# Altium project project3_SensorLEM.PrjPcb
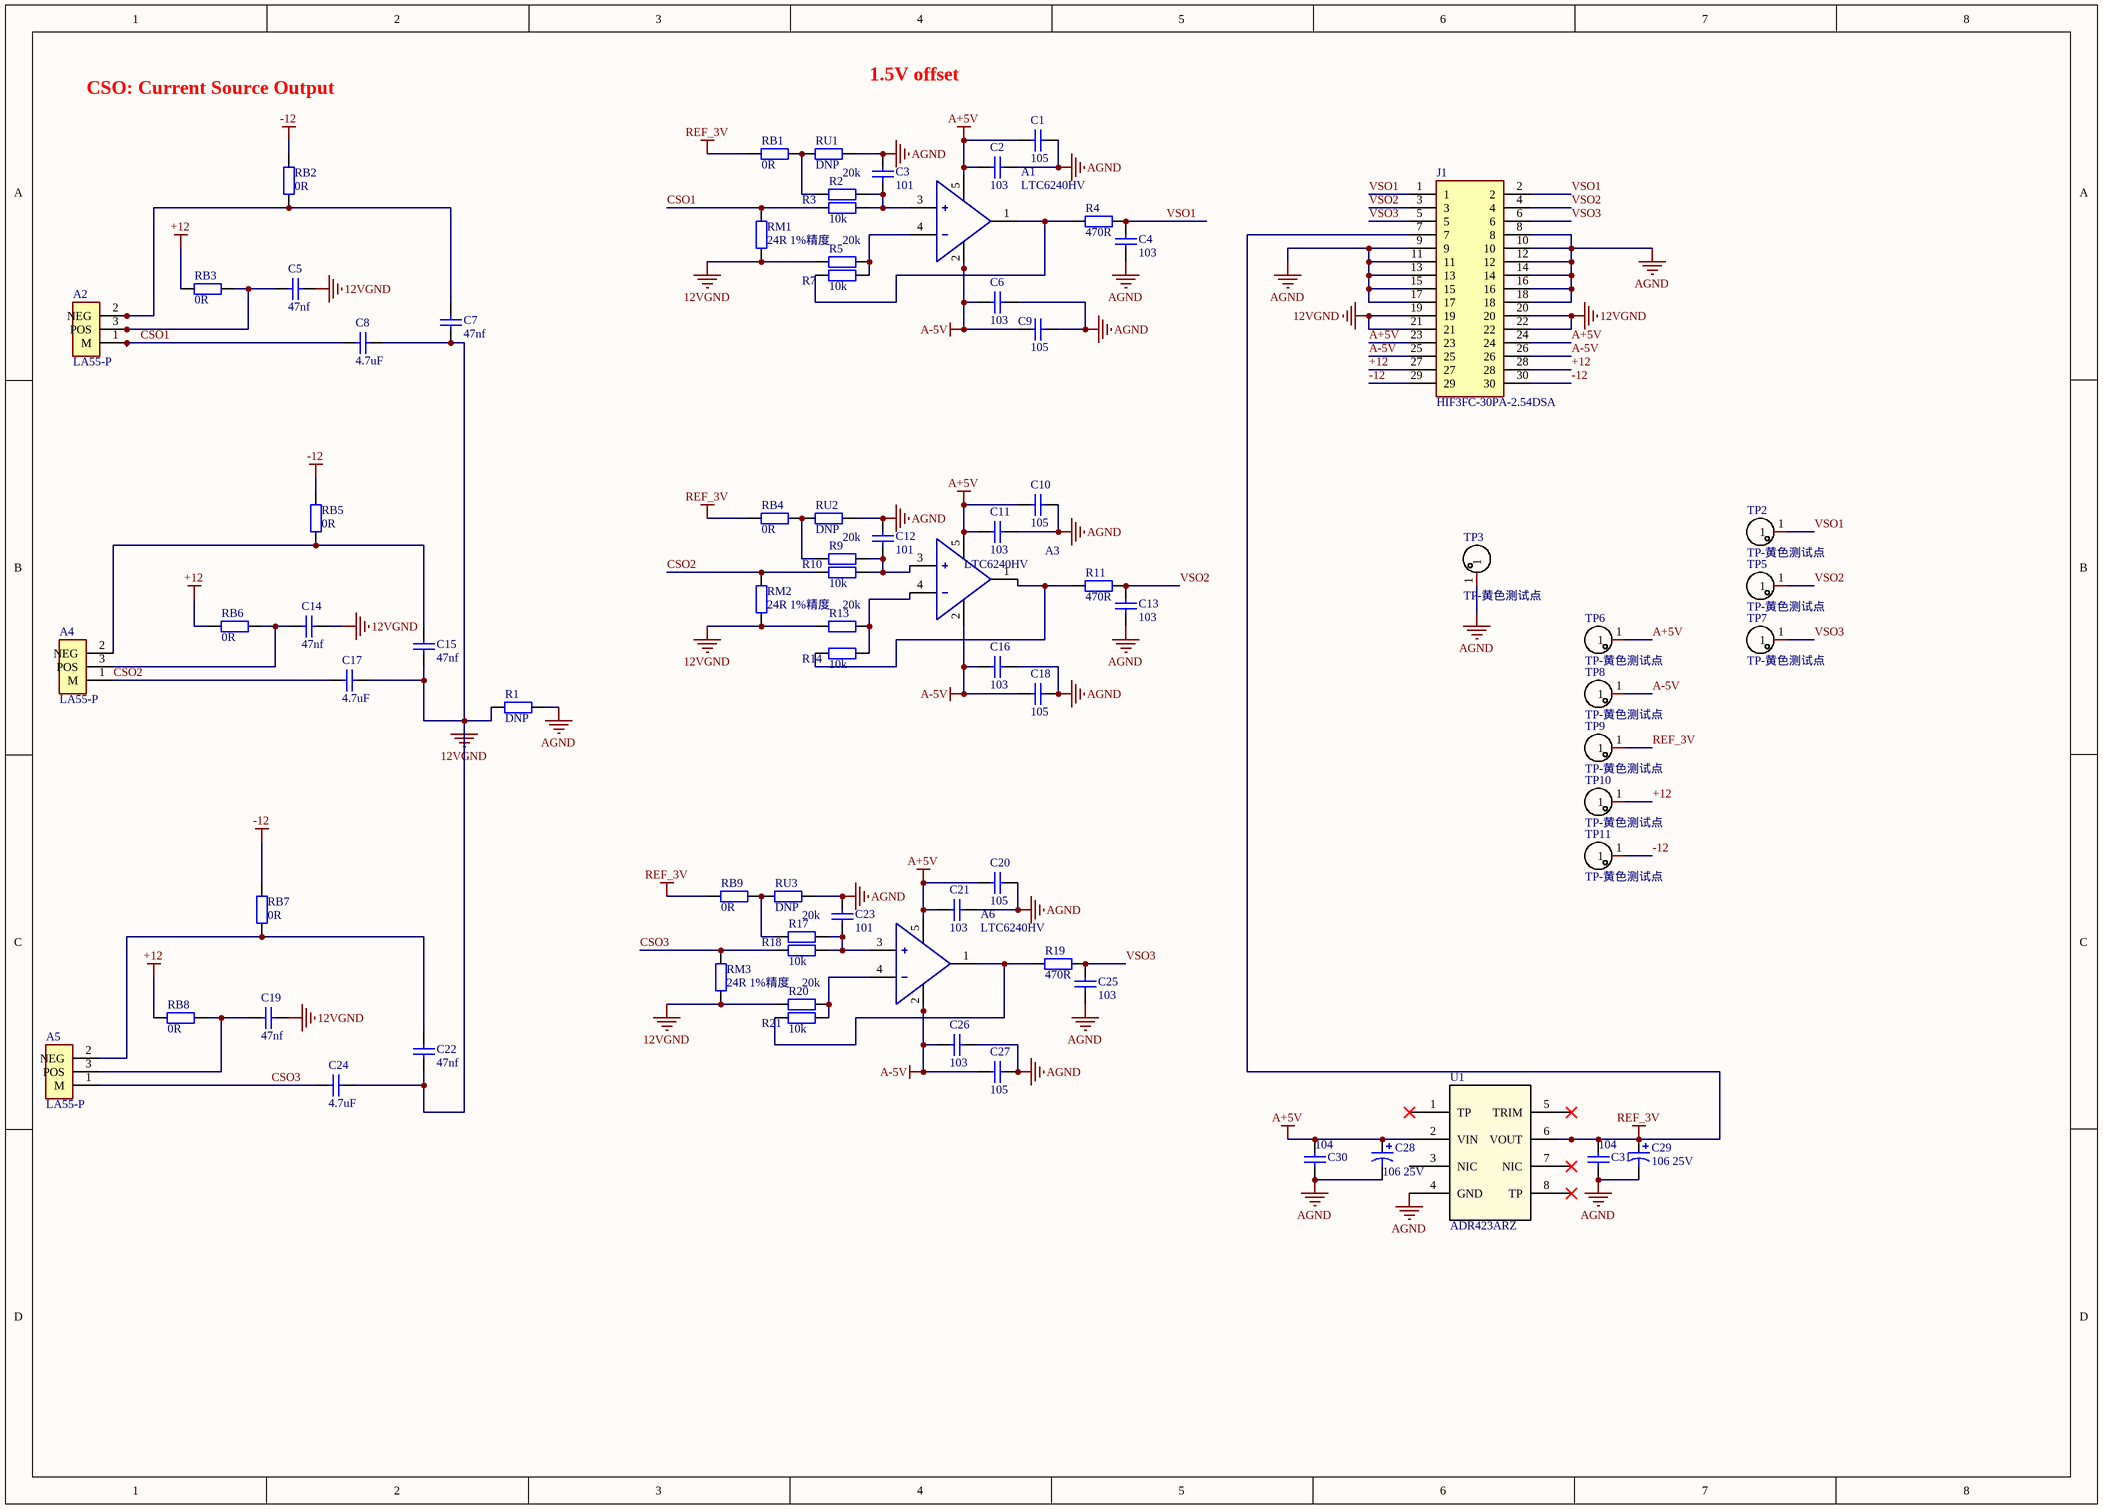
[diagram p0: sheet3.SchDoc]
1 sheet, 79 parts. Net scope: global (net labels, ports and power ports of the same name join across sheets).
Board file: PCB3.PcbDoc

## Sheet sheet3.SchDoc
size A3

### Parts
A1  LTC6240HV  [SOT95P280X100-5N]
A2  LA55-P  [XDCR_LA55-P]
A3  LTC6240HV  [SOT95P280X100-5N]
A4  LA55-P  [XDCR_LA55-P]
A5  LA55-P  [XDCR_LA55-P]
A6  LTC6240HV  [SOT95P280X100-5N]
C1  105  [0805]
C2  103  [0805]
C3  101  [0805]
C4  103  [0805]
C5  47nf  [0805]
C6  103  [0805]
C7  47nf  [0805]
C8  4.7uF  [0805]
C9  105  [0805]
C10  105  [0805]
C11  103  [0805]
C12  101  [0805]
C13  103  [0805]
C14  47nf  [0805]
C15  47nf  [0805]
C16  103  [0805]
C17  4.7uF  [0805]
C18  105  [0805]
C19  47nf  [0805]
C20  105  [0805]
C21  103  [0805]
C22  47nf  [0805]
C23  101  [0805]
C24  4.7uF  [0805]
C25  103  [0805]
C26  103  [0805]
C27  105  [0805]
C28  106 25V  [1206 (钽电容)]
C29  106 25V  [1206 (钽电容)]
C30  104  [0805]
C31  104  [0805]
J1  HIF3FC-30PA-2.54DSA  [SHDR30W50P254_2X15_4560X850X1200P]
R1  DNP  [0805]
R2  20k  [0805]
R3  10k  [0805]
R4  470R  [0805]
R5  20k  [0805]
R7  10k  [0805]
R9  20k  [0805]
R10  10k  [0805]
R11  470R  [0805]
R13  20k  [0805]
R14  10k  [0805]
R17  20k  [0805]
R18  10k  [0805]
R19  470R  [0805]
R20  20k  [0805]
R21  10k  [0805]
RB1  0R  [0805]
RB2  0R  [0805]
RB3  0R  [0805]
RB4  0R  [0805]
RB5  0R  [0805]
RB6  0R  [0805]
RB7  0R  [0805]
RB8  0R  [0805]
RB9  0R  [0805]
RM1  24R 1%精度  [2512]
RM2  24R 1%精度  [2512]
RM3  24R 1%精度  [2512]
RU1  DNP  [0805]
RU2  DNP  [0805]
RU3  DNP  [0805]
TP2  TP-黄色测试点  [TESTPOINT-TH_BD1.0]
TP3  TP-黄色测试点  [TESTPOINT-TH_BD1.0]
TP5  TP-黄色测试点  [TESTPOINT-TH_BD1.0]
TP6  TP-黄色测试点  [TESTPOINT-TH_BD1.0]
TP7  TP-黄色测试点  [TESTPOINT-TH_BD1.0]
TP8  TP-黄色测试点  [TESTPOINT-TH_BD1.0]
TP9  TP-黄色测试点  [TESTPOINT-TH_BD1.0]
TP10  TP-黄色测试点  [TESTPOINT-TH_BD1.0]
TP11  TP-黄色测试点  [TESTPOINT-TH_BD1.0]
U1  ADR423ARZ  [SOIC-8]

### Nets
12VGND: C5.1 C7.2 C8.2 C14.1 C15.2 C17.2 C19.1 C22.2 C24.2 J1.19 J1.20 J1.21 J1.22 R1.2 R5.1 R13.1 R20.1 RM1.2 RM2.2 RM3.2
+12: J1.27 J1.28 RB3.1 RB6.1 RB8.1 TP10.1
-12: J1.29 J1.30 RB2.2 RB5.2 RB7.2 TP11.1
A+5V: A1.5(Vcc) A3.5(Vcc) A6.5(Vcc) C1.2 C2.2 C10.2 C11.2 C20.2 C21.2 C28.1 C30.2 J1.23 J1.24 TP6.1 U1.2(VIN)
A-5V: A1.2(Vee) A3.2(Vee) A6.2(Vee) C6.2 C9.2 C16.2 C18.2 C26.2 C27.2 J1.25 J1.26 TP8.1
AGND: C1.1 C2.1 C3.2 C4.1 C6.1 C9.1 C10.1 C11.1 C12.2 C13.1 C16.1 C18.1 C20.1 C21.1 C23.2 C25.1 C26.1 C27.1 C28.2 C29.2 C30.1 C31.1 J1.8 J1.9 J1.10 J1.11 J1.12 J1.13 J1.14 J1.15 J1.16 J1.17 J1.18 R1.1 RU1.2 RU2.2 RU3.2 TP3.1 U1.4(GND)
REF_3V: C29.1 C31.2 J1.7 RB1.1 RB4.1 RB9.1 TP9.1 U1.6(VOUT)
CSO1: A2.1(M) C8.1 R3.1 RM1.1
CSO2: A4.1(M) C17.1 R10.1 RM2.1
CSO3: A5.1(M) C24.1 R18.1 RM3.1
VSO1: C4.2 J1.1 J1.2 R4.1 TP2.1
VSO2: C13.2 J1.3 J1.4 R11.1 TP5.1
VSO3: C25.2 J1.5 J1.6 R19.1 TP7.1
NetA1_1: A1.1(out) R4.2 R7.1
NetA1_3: A1.3(+IN) C3.1 R2.2 R3.2
NetA1_4: A1.4(-IN) R5.2 R7.2
NetA2_2: A2.2(NEG) C7.1 RB2.1
NetA2_3: A2.3(POS) C5.2 RB3.2
NetA3_1: A3.1(out) R11.2 R14.1
NetA3_3: A3.3(+IN) C12.1 R9.2 R10.2
NetA3_4: A3.4(-IN) R13.2 R14.2
NetA4_2: A4.2(NEG) C15.1 RB5.1
NetA4_3: A4.3(POS) C14.2 RB6.2
NetA5_2: A5.2(NEG) C22.1 RB7.1
NetA5_3: A5.3(POS) C19.2 RB8.2
NetA6_1: A6.1(out) R19.2 R21.1
NetA6_3: A6.3(+IN) C23.1 R17.2 R18.2
NetA6_4: A6.4(-IN) R20.2 R21.2
NetR2_1: R2.1 RB1.2 RU1.1
NetR9_1: R9.1 RB4.2 RU2.1
NetR17_1: R17.1 RB9.2 RU3.1

Not connected (* = marked no-connect by the designer): U1 1(TP)* 3(NIC) 5(TRIM)* 7(NIC)* 8(TP)*

### Notes on the sheet
- CSO: Current Source Output
- 1.5V offset

### Library data of the parts
A1 A3 A6 = AO_LTC6240HV: OP AMP, +-5.5V, 18MHZ, 10V/US, 5TSOT23; Produttore: LINEAR TECHNOLOGY; Codice produttore: LTC6240HVHS5#PBF; Classe: IC; Farnell #: 2294747; Package: sot23-5
A2 A4 A5 = LA55-P: Current Sensor 50A 1 Channel Hall Effect, Closed Loop Bidirectional Module, Single Pass Through; MF: LEM USA; MP: LA 55-P; Availability: Unavailable; SnapEDA_Link: https://www.snapeda.com/parts/LA%2055-P/LEM%20USA%20Inc./view-part/38924/?ref=snap; Value: *; Package: Module LEM USA; Price: None
C1 C2 C4 C6 C9-C11 C13 C16 C18 C20 C21 C25-C27 = Cap: Capacitor; Value: 101; Published: 8-Jun-2000; LatestRevisionDate: 17-Jul-2002; LatestRevisionNote: Re-released for DXP Platform.; PackageReference: RAD-0.3; Publisher: Altium Limited
C3 C12 C23 = Cap: Capacitor; Published: 8-Jun-2000; LatestRevisionDate: 17-Jul-2002; LatestRevisionNote: Re-released for DXP Platform.; PackageReference: RAD-0.3; Publisher: Altium Limited; Value: 101
C5 C7 C8 C14 C15 C17 C19 C22 C24 C30 C31 = Cap Semi: Capacitor (Semiconductor SIM Model); Published: 8-Jun-2000; LatestRevisionDate: 17-Jul-2002; LatestRevisionNote: Re-released for DXP Platform.; PackageReference: C1206; Publisher: Altium Limited
  C30 C31: ClassName: Power
C28 C29 = Cap Pol3: Polarized Capacitor (Surface Mount); Value: 100pF; Published: 8-Jun-2000; LatestRevisionDate: 29-May-2009; LatestRevisionNote: IPC-7351 Footprint Added.; PackageReference: C0805; Publisher: Altium Limited; PackageDescription: Chip Capacitor; ClassName: Power
J1 = HIF3FC-30PA-2.54DSA: Connector; Manufacturer_Name: Hirose; Manufacturer_Part_Number: HIF3FC-30PA-2.54DSA(71); Datasheet Link: https://datasheet.datasheetarchive.com/originals/distributors/SFDatasheet-7/sf-000141320.pdf; Height: 12mm; Mouser Part Number: 798-HIF3FC30PA254D71; Mouser Price/Stock: https://www.mouser.co.uk/ProductDetail/Hirose-Connector/HIF3FC-30PA-254DSA71?qs=eDUdFcBPps32%2FyAdBVx6ww%3D%3D
R1 R3 R4 R7 R10 R11 R14 R18 R19 R21 = Res2: Resistor; Published: 8-Jun-2000; LatestRevisionDate: 17-Jul-2002; LatestRevisionNote: Re-released for DXP Platform.; PackageReference: AXIAL-0.4; Publisher: Altium Limited
  R3 R7 R10 R14 R18 R21: Value: 10K
  R4 R11 R19: Value: 470R
R2 R5 R9 R13 R17 R20 RB1-RB9 RU1-RU3 = Res2: Resistor; Value: 10K; Published: 8-Jun-2000; LatestRevisionDate: 17-Jul-2002; LatestRevisionNote: Re-released for DXP Platform.; PackageReference: AXIAL-0.4; Publisher: Altium Limited
RM1-RM3 = Res2: Resistor; Value: 3.3K; Published: 8-Jun-2000; LatestRevisionDate: 17-Jul-2002; LatestRevisionNote: Re-released for DXP Platform.; PackageReference: AXIAL-0.4; Publisher: Altium Limited; PackageDescription: Axial Device, Thru-Hole; 2 Leads; 0.4 in Pin Spacing
TP2 TP3 TP5-TP11 = TP-黄色测试点: Add into BOM: yes; Name: TP-黄色测试点; Symbol: TP-黄色测试点; Device: TP-黄色测试点; LCSC Part Name: TP-黄色测试点; Supplier Part: C9900007422; Manufacturer Part: TP-黄色测试点; Supplier Footprint: TESTPOINT-TH_BD-2P-P2.00; JLCPCB Part Class: Extended Part; Datasheet: https://atta.szlcsc.comnull; Supplier: LCSC; Convert to PCB: yes
U1 = ADR423ARZ: Imported; Manufacturer_Part_Number: ADR423ARZ; Vendor: Vendor; Value: Value; Type: Type; RefDes: Refdes; ClassName: Power